# Altium schematic sheet RTC.SchDoc
size A4
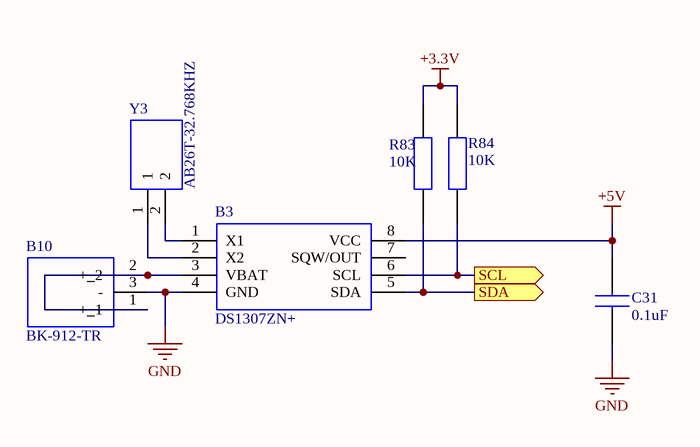
[diagram p0: RTC.SchDoc]

## Parts
B3  DS1307ZN+  [SOIC127P600X175-8N]
B10  BK-912-TR  [BK912TR]
C31  0.1uF  [CAPC1005X55N]
R83  10K  [RESC1005X40N]
R84  10K  [RESC1005X40N]
Y3  AB26T-32.768KHZ  [AB26T]

## Ports
SCL (out), SDA (out)

## Nets
+3.3V: R83.2 R84.2
+5V: B3.8(VCC) C31.2
GND: B3.4(GND) B10.3(-) C31.1
SCL: B3.6(SCL) R84.1 ; port SCL
SDA: B3.5(SDA) R83.1 ; port SDA
NetB3_1: B3.1(X1) Y3.2
NetB3_2: B3.2(X2) Y3.1
NetB3_3: B3.3(VBAT) B10.1(+_1) B10.2(+_2)

Not connected (* = marked no-connect by the designer): B3 7(SQW/OUT)

## Library data of the parts
B3 = DS1307ZN+: DS1307ZN+, Real Time Clock, Calendar, Clock, 56B RAM, I2C, 8-Pin SOIC; Manufacturer_Name: Maxim Integrated; Geometry.Height: 1.75mm; Manufacturer_Part_Number: DS1307ZN+; Arrow Part Number: DS1307ZN+; Arrow Price/Stock: *; Mouser Part Number: 700-DS1307ZN; Mouser Price/Stock: https://www.mouser.co.uk/ProductDetail/Maxim-Integrated/DS1307ZN%2b?qs=0Y9aZN%252BMVCXLWsJnSCEZfw%3D%3D; Datasheet Link: https://datasheets.maximintegrated.com/en/ds/DS1307.pdf
B10 = BK-912-TR: BATTERY RETAINER COIN 20MM SMD; Manufacturer_Name: MPD (Memory Protection Devices); Geometry.Height: 4.32mm; Manufacturer_Part_Number: BK-912-TR; Arrow Part Number: BK-912-TR; Arrow Price/Stock: *; Mouser Part Number: *; Mouser Price/Stock: *; Datasheet Link: https://www.memoryprotectiondevices.com/datasheets/BK-912-datasheet.pdf
C31 = C0402C104M4RECTU: Multilayer Ceramic Capacitors MLCC - SMD/SMT 16V 0.1uF X7R 0402 20%; Manufacturer_Name: Kemet; Geometry.Height: 0.55mm; Manufacturer_Part_Number: C0402C104M4RECTU; Arrow Part Number: C0402C104M4RECTU; Arrow Price/Stock: *; Mouser Part Number: 80-C0402C104M4RECTU; Mouser Price/Stock: https://www.mouser.com/Search/Refine.aspx?Keyword=80-C0402C104M4RECTU; Datasheet Link: https://content.kemet.com/datasheets/KEM_C1002_X7R_SMD.pdf
R83 R84 = RC0402JR-0710KL: YAGEO (PHYCOMP) - RC0402JR-0710KL - RES, THICK FILM, 10K, 5%, 0.0625W, 0402; Geometry.Height: 0.4mm; Manufacturer_Name: YAGEO (PHYCOMP); Manufacturer_Part_Number: RC0402JR-0710KL; Arrow Part Number: RC0402JR-0710KL; Arrow Price/Stock: *; Mouser Part Number: 603-RC0402JR-0710KL; Mouser Price/Stock: https://www.mouser.co.uk/ProductDetail/Yageo/RC0402JR-0710KL?qs=V1yeUXFNrkk4BhFptVo0Rw%3D%3D; Datasheet Link: http://www.yageo.com/documents/recent/PYu-RC0402_51_RoHS_L_6_r.pdf
Y3 = AB26T-32.768KHZ: Crystal 32.768kHz, +/-20ppm Cylindrical Can, Radial, 2.1 x 6.2mm; Manufacturer_Name: ABRACON; Manufacturer_Part_Number: AB26T-32.768KHZ; Arrow Part Number: AB26T-32.768KHZ; Arrow Price/Stock: https://www.arrow.com/en/products/ab26t-32.768khz/abracon; Mouser Part Number: 815-AB26T-32.768KHZ; Mouser Price/Stock: https://www.mouser.co.uk/ProductDetail/ABRACON/AB26T-32768KHZ?qs=m%252BUhWDcpCfZq%2FBFfwzExYQ%3D%3D; Datasheet Link: https://abracon.com/Resonators/AB26T.pdf